# Altium project S6D01D4NucleoExtensionBoard.PrjPcb
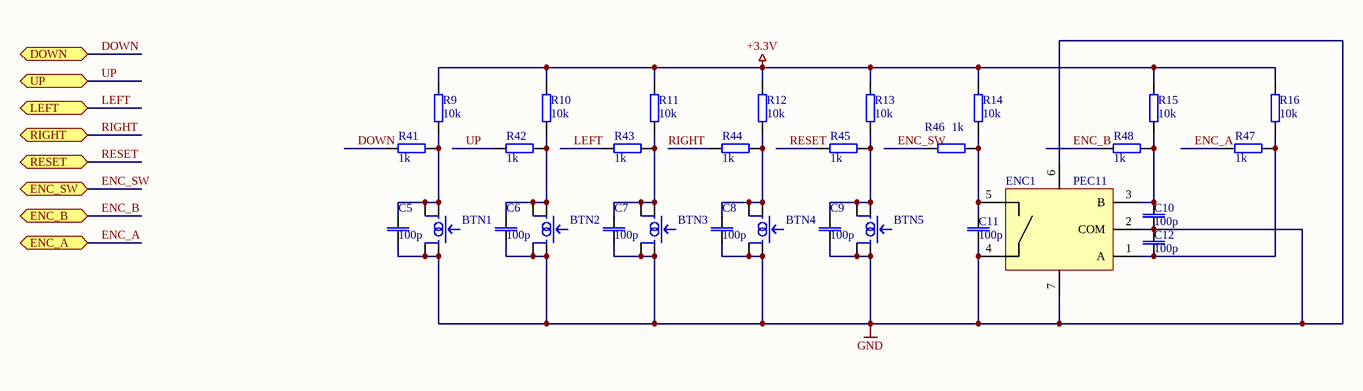
[diagram p0: Inputs.SchDoc]
6 sheets, 71 parts. Net scope: hierarchical (ports join the sheet entries above them; power ports are global).
Board files: S6D01D4NucleoExtensionBoard1_values.PcbDoc, S6D01D4NucleoExtensionBoard1.PcbDoc
Sheets:
  Inputs.SchDoc
  Nucleo.SchDoc
  Wireless.SchDoc
  H-Bridge.SchDoc
  LightSensor.SchDoc
  I2Cbus.SchDoc

## Sheet Inputs.SchDoc
size A4

### Parts
BTN1  (no value)  [PBUTTON_SMD]
BTN2  (no value)  [PBUTTON_SMD]
BTN3  (no value)  [PBUTTON_SMD]
BTN4  (no value)  [PBUTTON_SMD]
BTN5  (no value)  [PBUTTON_SMD]
C5  100p  [CAP 0805]
C6  100p  [CAP 0805]
C7  100p  [CAP 0805]
C8  100p  [CAP 0805]
C9  100p  [CAP 0805]
C10  100p  [CAP 0805]
C11  100p  [CAP 0805]
C12  100p  [CAP 0805]
ENC1  PEC11  [PEC11]
R9  10k  [RES 0805]
R10  10k  [RES 0805]
R11  10k  [RES 0805]
R12  10k  [RES 0805]
R13  10k  [RES 0805]
R14  10k  [RES 0805]
R15  10k  [RES 0805]
R16  10k  [RES 0805]
R41  1k  [RES 0805]
R42  1k  [RES 0805]
R43  1k  [RES 0805]
R44  1k  [RES 0805]
R45  1k  [RES 0805]
R46  1k  [RES 0805]
R47  1k  [RES 0805]
R48  1k  [RES 0805]

### Ports
DOWN (bidir), ENC_A (bidir), ENC_B (bidir), ENC_SW (bidir), LEFT (bidir), RESET (bidir), RIGHT (bidir), UP (bidir)

### Nets
+3.3V: R9.2 R10.2 R11.2 R12.2 R13.2 R14.2 R15.2 R16.2
GND: BTN1.1 BTN1.2 BTN2.1 BTN2.2 BTN3.1 BTN3.2 BTN4.1 BTN4.2 BTN5.1 BTN5.2 C5.1 C6.1 C7.1 C8.1 C9.1 C10.1 C11.1 C12.2 ENC1.2(COM) ENC1.4 ENC1.6 ENC1.7
DOWN: R41.1 ; port DOWN
ENC_A: R47.1 ; port ENC_A
ENC_B: R48.1 ; port ENC_B
ENC_SW: R46.1 ; port ENC_SW
LEFT: R43.1 ; port LEFT
RESET: R45.1 ; port RESET
RIGHT: R44.1 ; port RIGHT
UP: R42.1 ; port UP
NetBTN1_3: BTN1.3 BTN1.4 C5.2 R9.1 R41.2
NetBTN2_3: BTN2.3 BTN2.4 C6.2 R10.1 R42.2
NetBTN3_3: BTN3.3 BTN3.4 C7.2 R11.1 R43.2
NetBTN4_3: BTN4.3 BTN4.4 C8.2 R12.1 R44.2
NetBTN5_3: BTN5.3 BTN5.4 C9.2 R13.1 R45.2
NetC10_2: C10.2 ENC1.3(B) R15.1 R48.2
NetC11_2: C11.2 ENC1.5 R14.1 R46.2
NetC12_1: C12.1 ENC1.1(A) R16.1 R47.2

### Library data of the parts
BTN1-BTN5 = PUSHBUTTON: Tactile push button; Datasheet: http://www.farnell.com/datasheets/2706291.pdf
C5-C12 = CAP: NON POLARIZED CAPACITOR; VALUE: 100p; Reference: 82-01-25; Supplier: LOMEX
ENC1 = PEC11: Mechanical rotary encoder with pushbutton; Name: PEC11; Datasheet: https://www.bourns.com/data/global/pdfs/PEC11_obsolete.pdf
R9-R16 R41-R48 = RES: RESISTOR; Reference: 81-10-99; Supplier: LOMEX
  R9-R16: VALUE: 10k
  R41-R48: VALUE: 1k

## Sheet Nucleo.SchDoc
size A4
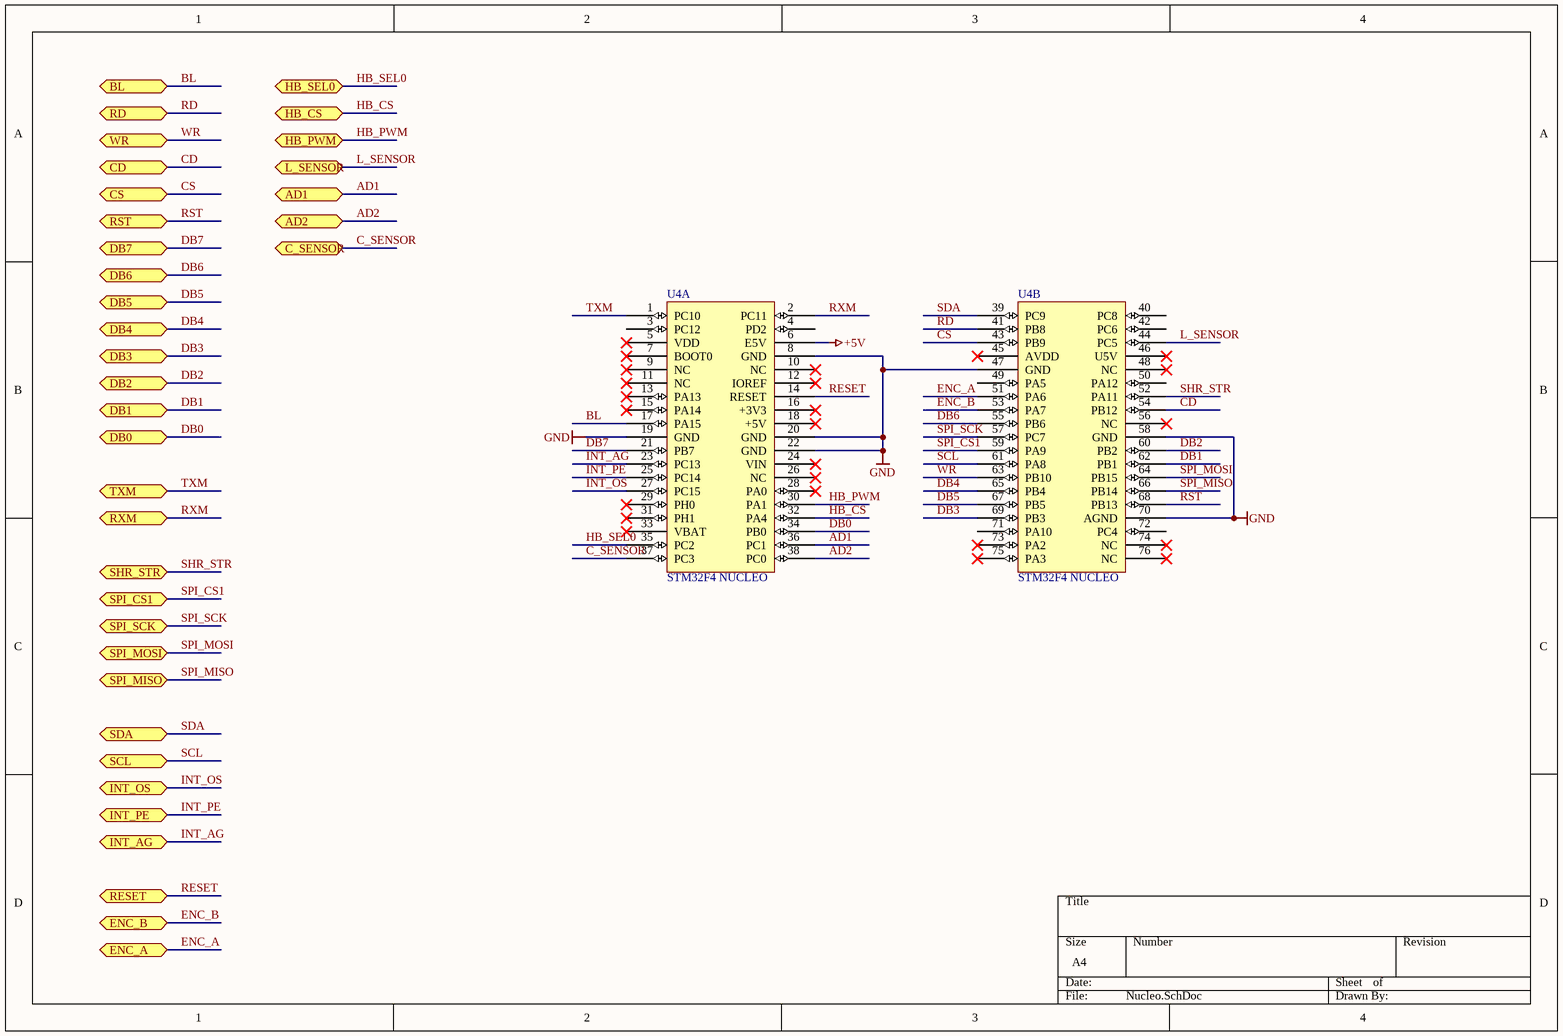
[diagram p1: Nucleo.SchDoc]

### Parts
U4  STM32F4 NUCLEO  [STM32F4xx_Nucleo]  (parts A,B of 2)

### Ports
AD1 (bidir), AD2 (bidir), BL (bidir), C_SENSOR (bidir), CD (bidir), CS (bidir), DB0 (bidir), DB1 (bidir), DB2 (bidir), DB3 (bidir), DB4 (bidir), DB5 (bidir), DB6 (bidir), DB7 (bidir), ENC_A (bidir), ENC_B (bidir), HB_CS (bidir), HB_PWM (bidir), HB_SEL0 (bidir), INT_AG (bidir), INT_OS (bidir), INT_PE (bidir), L_SENSOR (bidir), RD (bidir), RESET (bidir), RST (bidir), RXM (bidir), SCL (bidir), SDA (bidir), SHR_STR (bidir), SPI_CS1 (bidir), SPI_MISO (bidir), SPI_MOSI (bidir), SPI_SCK (bidir), TXM (bidir), WR (bidir)

### Nets
+5V: U4.6(E5V)
GND: U4.8(GND) U4.19(GND) U4.20(GND) U4.22(GND) U4.47(GND) U4.58(GND) U4.70(AGND)
AD1: U4.36(PC1) ; port AD1
AD2: U4.38(PC0) ; port AD2
BL: U4.17(PA15) ; port BL
C_SENSOR: U4.37(PC3) ; port C_SENSOR
CD: U4.54(PB12) ; port CD
CS: U4.43(PB9) ; port CS
DB0: U4.34(PB0) ; port DB0
DB1: U4.62(PB1) ; port DB1
DB2: U4.60(PB2) ; port DB2
DB3: U4.69(PB3) ; port DB3
DB4: U4.65(PB4) ; port DB4
DB5: U4.67(PB5) ; port DB5
DB6: U4.55(PB6) ; port DB6
DB7: U4.21(PB7) ; port DB7
ENC_A: U4.51(PA6) ; port ENC_A
ENC_B: U4.53(PA7) ; port ENC_B
HB_CS: U4.32(PA4) ; port HB_CS
HB_PWM: U4.30(PA1) ; port HB_PWM
HB_SEL0: U4.35(PC2) ; port HB_SEL0
INT_AG: U4.23(PC13) ; port INT_AG
INT_OS: U4.27(PC15) ; port INT_OS
INT_PE: U4.25(PC14) ; port INT_PE
L_SENSOR: U4.44(PC5) ; port L_SENSOR
RD: U4.41(PB8) ; port RD
RESET: U4.14(RESET) ; port RESET
RST: U4.68(PB13) ; port RST
RXM: U4.2(PC11) ; port RXM
SCL: U4.61(PA8) ; port SCL
SDA: U4.39(PC9) ; port SDA
SHR_STR: U4.52(PA11) ; port SHR_STR
SPI_CS1: U4.59(PA9) ; port SPI_CS1
SPI_MISO: U4.66(PB14) ; port SPI_MISO
SPI_MOSI: U4.64(PB15) ; port SPI_MOSI
SPI_SCK: U4.57(PC7) ; port SPI_SCK
TXM: U4.1(PC10) ; port TXM
WR: U4.63(PB10) ; port WR

Not connected (* = marked no-connect by the designer): U4 3(PC12) 4(PD2) 5(VDD)* 7(BOOT0)* 9(NC)* 10(NC)* 11(NC)* 12(IOREF)* 13(PA13)* 15(PA14)* 16(+3V3)* 18(+5V)* 24(VIN)* 26(NC)* 28(PA0)* 29(PH0)* 31(PH1)* 33(VBAT)* 40(PC8) 42(PC6) 45(AVDD)* 46(U5V)* 48(NC)* 49(PA5) 50(PA12) 56(NC)* 71(PA10) 72(PC4) 73(PA2)* 74(NC)* 75(PA3)* 76(NC)*

### Library data of the parts
U4 = NUCLEO-F446RE: STM32F4xx Nucleo board; Name: STM32F4 NUCLEO; Datasheet: https://www.st.com/content/ccc/resource/technical/document/user_manual/98/2e/fa/4b/e0/82/43/b7/DM00105823.pdf/files/DM00105823.pdf/jcr:content/translations/en.DM00105823.pdf

## Sheet Wireless.SchDoc
size A4
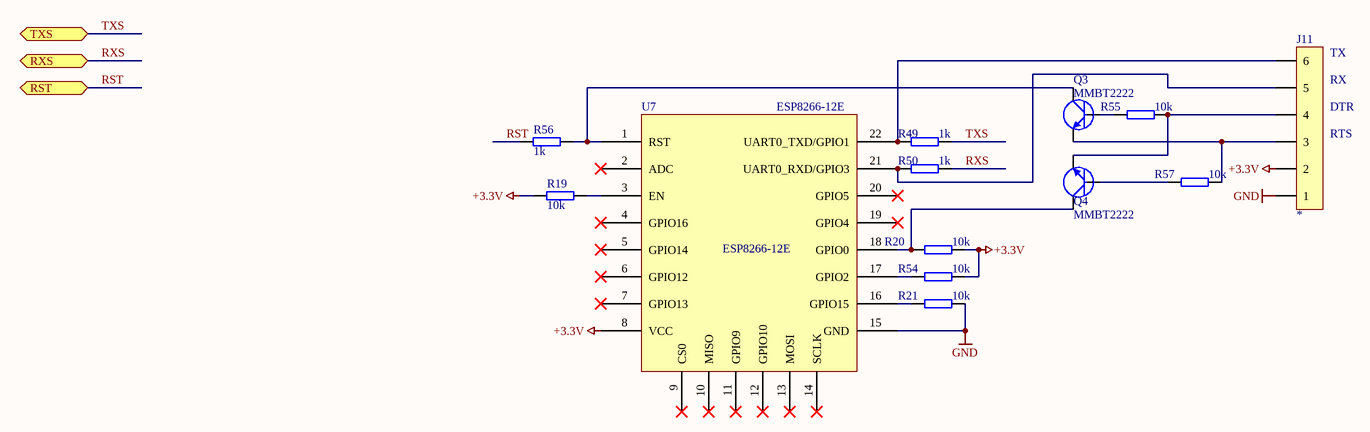
[diagram p2: Wireless.SchDoc]

### Parts
J11  *  [SIL6]
Q3  MMBT2222  [SOT23]
Q4  MMBT2222  [SOT23]
R19  10k  [RES 0805]
R20  10k  [RES 0805]
R21  10k  [RES 0805]
R49  1k  [RES 0805]
R50  1k  [RES 0805]
R54  10k  [RES 0805]
R55  10k  [RES 0805]
R56  1k  [RES 0805]
R57  10k  [RES 0805]
U7  ESP8266-12E  [ESP8266-12E]

### Ports
RST (bidir), RXS (bidir), TXS (bidir)

### Nets
+3.3V: J11.2 R19.1 R20.2 R54.2 U7.8(VCC)
GND: J11.1 R21.2 U7.15(GND)
RST: R56.1 ; port RST
RXS: R50.2 ; port RXS
TXS: R49.2 ; port TXS
NetJ11_3: J11.3 Q3.2(E) R57.2
NetJ11_4: J11.4 Q4.2(E) R55.2
NetJ11_5: J11.5 R50.1 U7.21(UART0_RXD/GPIO3)
NetJ11_6: J11.6 R49.1 U7.22(UART0_TXD/GPIO1)
NetQ3_1: Q3.1(B) R55.1
NetQ3_3: Q3.3(C) R56.2 U7.1(RST)
NetQ4_1: Q4.1(B) R57.1
NetQ4_3: Q4.3(C) R20.1 U7.18(GPIO0)
NetR19_2: R19.2 U7.3(EN)
NetR21_1: R21.1 U7.16(GPIO15)
NetR54_1: R54.1 U7.17(GPIO2)

Not connected (* = marked no-connect by the designer): U7 2(ADC)* 4(GPIO16)* 5(GPIO14)* 6(GPIO12)* 7(GPIO13)* 9(CS0)* 10(MISO)* 11(GPIO9)* 12(GPIO10)* 13(MOSI)* 14(SCLK)* 19(GPIO4)* 20(GPIO5)*

### Notes on the sheet
- (near J11) TX
- (near J11) RX
- (near J11) DTR
- (near J11) RTS

### Library data of the parts
J11 = HEADER6: 6 PIN HEADER; Value: *
Q3 Q4 = MMBT2222: NPN transistor, SO23; Name: MMBT2222; Datasheet: https://www.mouser.com/ds/2/149/MMBT2222-889752.pdf
R19-R21 R49 R50 R54-R57 = RES: RESISTOR
  R19-R21 R54 R55 R57: REFERENCE ID: *; DISTRIBUTOR: *; VALUE: 10k
  R49 R50: Reference: 81-10-99; Supplier: LOMEX; VALUE: 1k
  R56: REFERENCE ID: *; DISTRIBUTOR: *; VALUE: 1k
U7 = ESP8266-12E: WiFi module; Name: ESP8266-12E; Datasheet: https://www.elecrow.com/download/ESP-12F.pdf

## Sheet H-Bridge.SchDoc
size A4
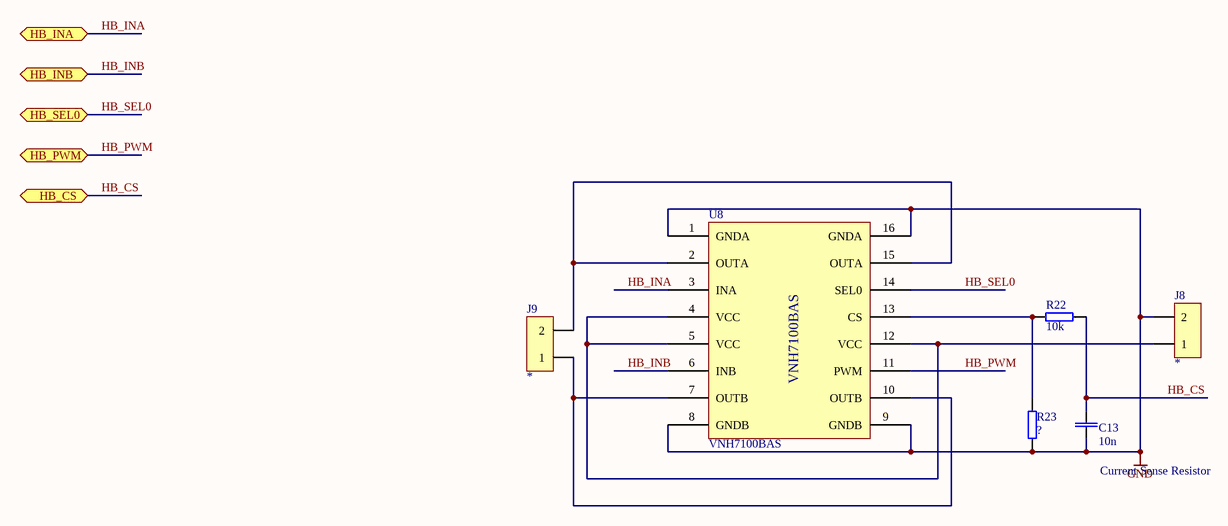
[diagram p3: H-Bridge.SchDoc]

### Parts
C13  10n  [CAP 0805]
J8  *  [PTR_AKZ350]
J9  *  [PTR_AKZ350]
R22  10k  [RES 0805]
R23  ?  [RES 0805]
U8  VNH7100BAS  [SO16N]

### Ports
HB_CS (bidir), HB_INA (bidir), HB_INB (bidir), HB_PWM (bidir), HB_SEL0 (bidir)

### Nets
GND: C13.1 J8.2 R23.2 U8.1(GNDA) U8.8(GNDB) U8.9(GNDB) U8.16(GNDA)
HB_CS: C13.2 R22.2 ; port HB_CS
HB_INA: U8.3(INA) ; port HB_INA
HB_INB: U8.6(INB) ; port HB_INB
HB_PWM: U8.11(PWM) ; port HB_PWM
HB_SEL0: U8.14(SEL0) ; port HB_SEL0
NetJ8_1: J8.1 U8.4(VCC) U8.5(VCC) U8.12(VCC)
NetJ9_1: J9.1 U8.7(OUTB) U8.10(OUTB)
NetJ9_2: J9.2 U8.2(OUTA) U8.15(OUTA)
NetR22_1: R22.1 R23.1 U8.13(CS)

### Notes on the sheet
- Current Sense Resistor

### Library data of the parts
C13 = CAP: NON POLARIZED CAPACITOR; VALUE: 10n; Reference: 82-01-25; Supplier: LOMEX
J8 J9 = HEADER2: 2 PIN HEADER; REFERENCE ID: *; DISTRIBUTOR: *; VALUE: *
R22 R23 = RES: RESISTOR; REFERENCE ID: *; DISTRIBUTOR: *
  R22: VALUE: 10k
  R23: VALUE: ?
U8 = VNH7100BAS: Automotive fully integrated H-bridge motor driver; Name: VNH7100BAS; Datasheet: https://www.st.com/resource/en/datasheet/dm00314832.pdf

## Sheet LightSensor.SchDoc
size A4
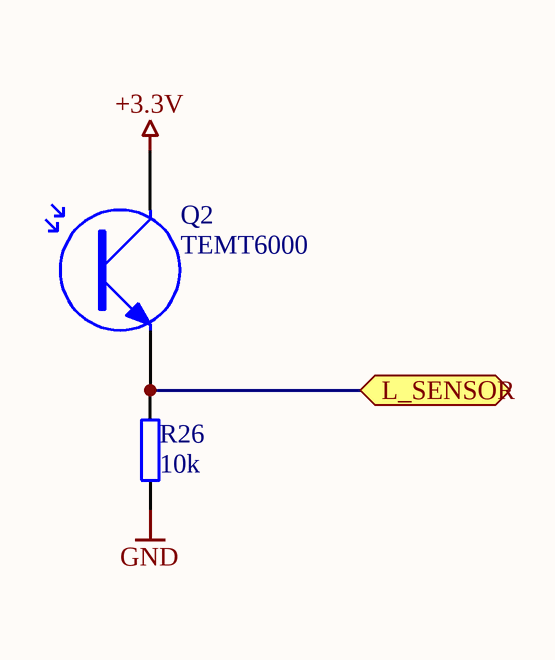
[diagram p4: LightSensor.SchDoc]

### Parts
Q2  TEMT6000  [TEMT600]
R26  10k  [RES 0805]

### Ports
L_SENSOR (bidir)

### Nets
+3.3V: Q2.1(C)
GND: R26.2
L_SENSOR: Q2.2(E) R26.1 ; port L_SENSOR

### Library data of the parts
Q2 = TEMT6000: Light sensor; Name: TEMT6000; Datasheet: https://www.sparkfun.com/datasheets/Sensors/Imaging/TEMT6000.pdf
R26 = RES: RESISTOR; REFERENCE ID: *; DISTRIBUTOR: *; VALUE: 10k

## Sheet I2Cbus.SchDoc
size A4
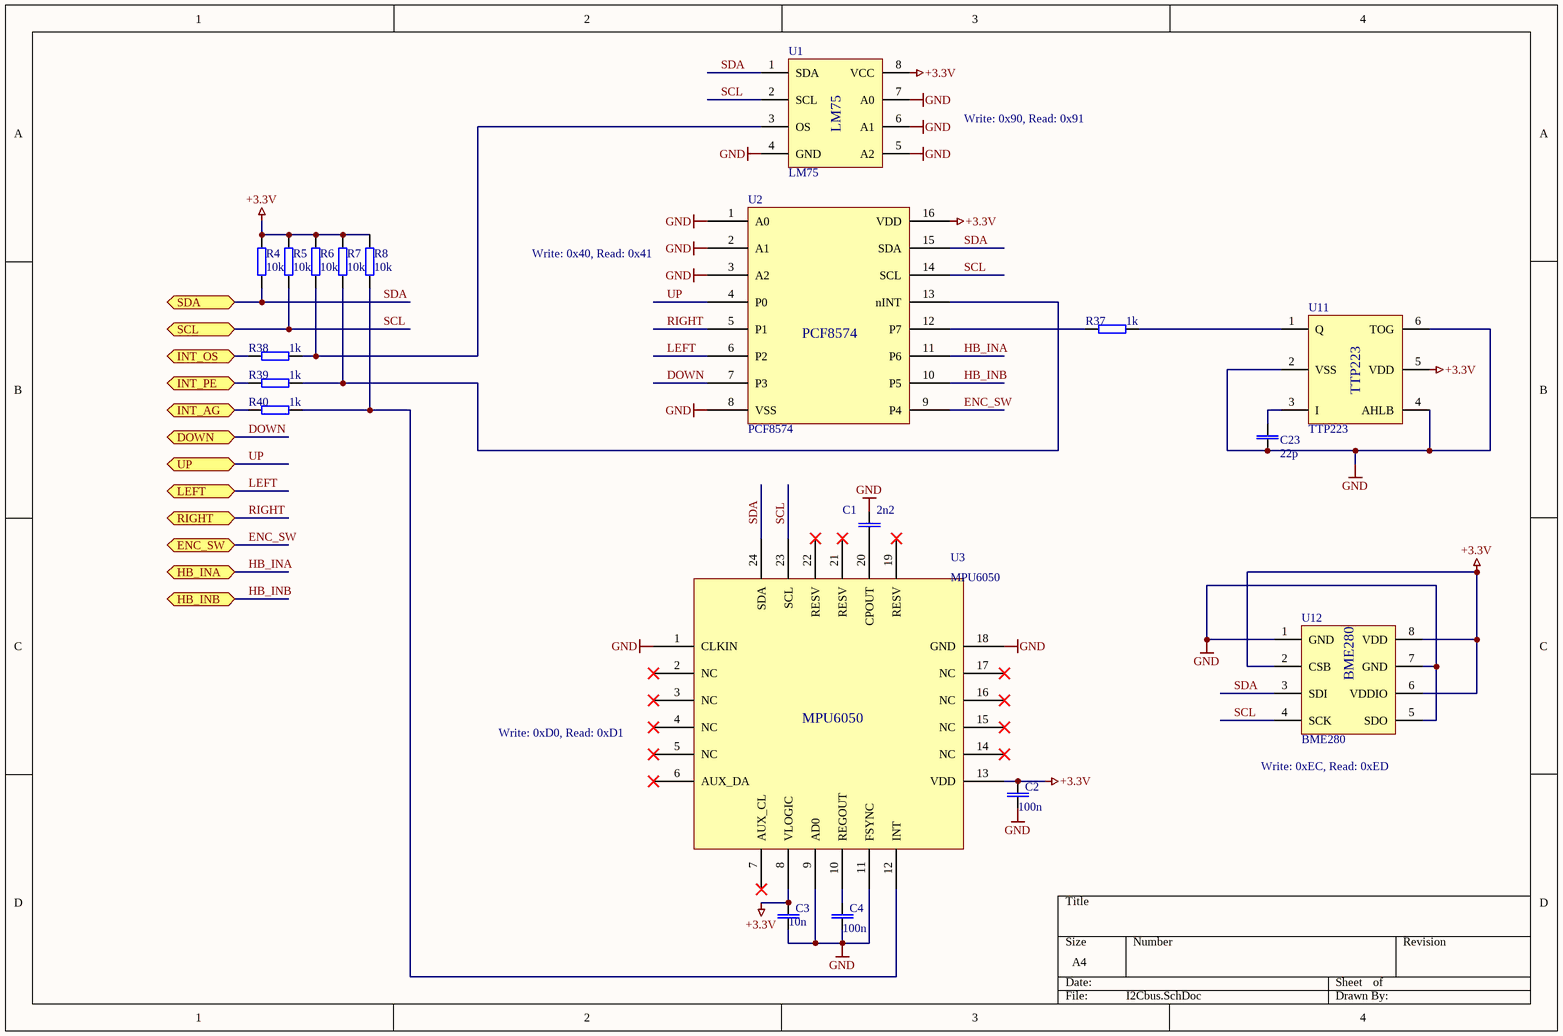
[diagram p5: I2Cbus.SchDoc]

### Parts
C1  2n2  [CAP 0805]
C2  100n  [CAP 0805]
C3  10n  [CAP 0805]
C4  100n  [CAP 0805]
C23  22p  [CAP 0805]
R4  10k  [RES 0805]
R5  10k  [RES 0805]
R6  10k  [RES 0805]
R7  10k  [RES 0805]
R8  10k  [RES 0805]
R37  1k  [RES 0805]
R38  1k  [RES 0805]
R39  1k  [RES 0805]
R40  1k  [RES 0805]
U1  LM75  [SO8]
U2  PCF8574  [SO16W]
U3  MPU6050  [QFN24]
U11  TTP223  [SOT-23-6L]
U12  BME280  [BME280]

### Ports
DOWN (bidir), ENC_SW (bidir), HB_INA (bidir), HB_INB (bidir), INT_AG (bidir), INT_OS (bidir), INT_PE (bidir), LEFT (bidir), RIGHT (bidir), SCL (bidir), SDA (bidir), UP (bidir)

### Nets
+3.3V: C2.1 C3.1 R4.2 R5.2 R6.2 R7.2 R8.2 U1.8(VCC) U2.16(VDD) U3.8(VLOGIC) U3.13(VDD) U11.5(VDD) U12.2(CSB) U12.6(VDDIO) U12.8(VDD)
GND: C1.2 C2.2 C3.2 C4.2 C23.2 U1.4(GND) U1.5(A2) U1.6(A1) U1.7(A0) U2.1(A0) U2.2(A1) U2.3(A2) U2.8(VSS) U3.1(CLKIN) U3.9(AD0) U3.11(FSYNC) U3.18(GND) U11.2(VSS) U11.4(AHLB) U11.6(TOG) U12.1(GND) U12.5(SDO) U12.7(GND)
DOWN: U2.7(P3) ; port DOWN
ENC_SW: U2.9(P4) ; port ENC_SW
HB_INA: U2.11(P6) ; port HB_INA
HB_INB: U2.10(P5) ; port HB_INB
INT_AG: R40.1 ; port INT_AG
INT_OS: R38.1 ; port INT_OS
INT_PE: R39.1 ; port INT_PE
LEFT: U2.6(P2) ; port LEFT
RIGHT: U2.5(P1) ; port RIGHT
SCL: R5.1 U1.2(SCL) U2.14(SCL) U3.23(SCL) U12.4(SCK) ; port SCL
SDA: R4.1 U1.1(SDA) U2.15(SDA) U3.24(SDA) U12.3(SDI) ; port SDA
UP: U2.4(P0) ; port UP
NetC1_1: C1.1 U3.20(CPOUT)
NetC4_1: C4.1 U3.10(REGOUT)
NetC23_1: C23.1 U11.3(I)
NetR6_1: R6.1 R38.2 U1.3(OS)
NetR7_1: R7.1 R39.2 U2.13(nINT)
NetR8_1: R8.1 R40.2 U3.12(INT)
NetR37_1: R37.1 U2.12(P7)
NetR37_2: R37.2 U11.1(Q)

Not connected (* = marked no-connect by the designer): U3 2(NC)* 3(NC)* 4(NC)* 5(NC)* 6(AUX_DA)* 7(AUX_CL)* 14(NC)* 15(NC)* 16(NC)* 17(NC)* 19(RESV)* 21(RESV)* 22(RESV)*

### Notes on the sheet
- Write: 0x90, Read: 0x91
- Write: 0x40, Read: 0x41
- Write: 0xD0, Read: 0xD1
- (near U12) Write: 0xEC, Read: 0xED

### Library data of the parts
C1-C4 C23 = CAP: NON POLARIZED CAPACITOR; Reference: 82-01-25; Supplier: LOMEX
  C1: VALUE: 2n2
  C2 C4: VALUE: 100n
  C3: VALUE: 10n
  C23: VALUE: 22p
R4-R8 R37-R40 = RES: RESISTOR
  R4-R8: REFERENCE ID: *; DISTRIBUTOR: *; VALUE: 10k
  R37-R40: Reference: 81-10-99; Supplier: LOMEX; VALUE: 1k
U1 = LM75: Temperature sensor with I2C interface; Name: LM75; Datasheet: https://datasheets.maximintegrated.com/en/ds/LM75.pdf
U2 = PCF8574: I/O expander I2C bus; Datasheet: http://www.ti.com/lit/ds/symlink/pcf8574.pdf; Name: PCF8574
U3 = MPU6050: 6 axis gyroscope and accelerometer sensor; Name: MPU6050; Datasheet: https://store.invensense.com/datasheets/invensense/MPU-6050_DataSheet_V3%204.pdf
U11 = TTP223: 1 KEY TOUCH PAD DETECTOR IC; Name: TTP223; Datasheet: https://datasheet.lcsc.com/szlcsc/TTP223-BA6_C80757.pdf
U12 = BME280: BME280 Environmental sensor; Name: BME280; Datasheet: https://www.embeddedadventures.com/datasheets/BME280.pdf

## Nets that join several sheets
+3.3V: Inputs (8 pins), Wireless (5 pins), LightSensor (Q2.1), I2Cbus (15 pins)
GND: Inputs (22 pins), Nucleo (7 pins), Wireless (J11.1 R21.2 U7.15), H-Bridge (7 pins), LightSensor (R26.2), I2Cbus (23 pins)